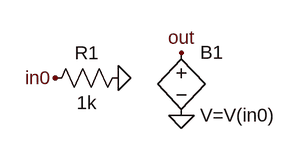
[diagram p0: schematic buffer.asc]
buffer.asc, the LTspice schematic file:
Version 4
SHEET 1 880 680
FLAG 64 96 in0
FLAG 144 96 0
FLAG 224 144 0
FLAG 224 64 out
SYMBOL res 160 80 R90
WINDOW 0 0 56 VBottom 2
WINDOW 3 32 56 VTop 2
SYMATTR InstName R1
SYMATTR Value 1k
SYMBOL bv 224 48 R0
SYMATTR InstName B1
SYMATTR Value V=V(in0)

The netlist it stands for:
* buffer.asc
R1 0 in0 1k
B1 out 0 V=V(in0)
.backanno
.end